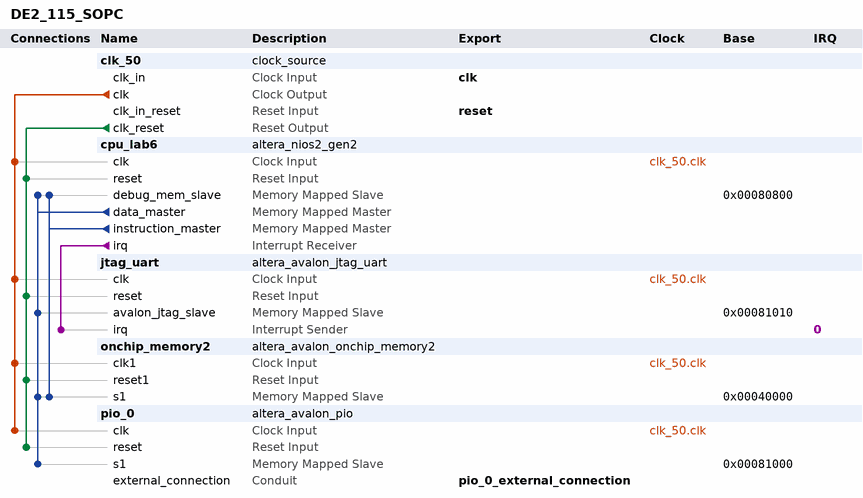
[diagram p0: system contents]
# Platform Designer (Qsys) system DE2_115_SOPC, Cyclone IV E EP4CE115F29C7
# Parameters at their usual value, and those the tool derives, are not listed.
package require -exact qsys 22.1
create_system DE2_115_SOPC
set_project_property DEVICE_FAMILY {Cyclone IV E}
set_project_property DEVICE EP4CE115F29C7

add_instance clk_50 clock_source 22.1
set_instance_parameter_value clk_50 clockFrequency 50000000

add_instance cpu_lab6 altera_nios2_gen2 22.1
set_instance_parameter_value cpu_lab6 dcache_size 2048
set_instance_parameter_value cpu_lab6 exceptionSlave onchip_memory2.s1
set_instance_parameter_value cpu_lab6 icache_size 4096
set_instance_parameter_value cpu_lab6 impl Fast
set_instance_parameter_value cpu_lab6 resetSlave onchip_memory2.s1

add_instance jtag_uart altera_avalon_jtag_uart 22.1
set_instance_parameter_value jtag_uart simInteractiveOptions NO_INTERACTIVE_WINDOWS

add_instance onchip_memory2 altera_avalon_onchip_memory2 22.1
set_instance_parameter_value onchip_memory2 dataWidth 32
set_instance_parameter_value onchip_memory2 dualPort false
set_instance_parameter_value onchip_memory2 initMemContent true
set_instance_parameter_value onchip_memory2 initializationFileName onchip_mem.hex
set_instance_parameter_value onchip_memory2 memorySize 204800

add_instance pio_0 altera_avalon_pio 22.1
set_instance_parameter_value pio_0 direction Output
set_instance_parameter_value pio_0 width 8

# connections
add_connection clk_50.clk cpu_lab6.clk clock
add_connection clk_50.clk jtag_uart.clk clock
add_connection clk_50.clk onchip_memory2.clk1 clock
add_connection clk_50.clk pio_0.clk clock
add_connection clk_50.clk_reset cpu_lab6.reset reset
add_connection clk_50.clk_reset jtag_uart.reset reset
add_connection clk_50.clk_reset onchip_memory2.reset1 reset
add_connection clk_50.clk_reset pio_0.reset reset
add_connection cpu_lab6.data_master cpu_lab6.debug_mem_slave avalon
set_connection_parameter_value cpu_lab6.data_master/cpu_lab6.debug_mem_slave baseAddress 0x00080800
add_connection cpu_lab6.data_master jtag_uart.avalon_jtag_slave avalon
set_connection_parameter_value cpu_lab6.data_master/jtag_uart.avalon_jtag_slave baseAddress 0x00081010
add_connection cpu_lab6.data_master onchip_memory2.s1 avalon
set_connection_parameter_value cpu_lab6.data_master/onchip_memory2.s1 baseAddress 0x00040000
add_connection cpu_lab6.data_master pio_0.s1 avalon
set_connection_parameter_value cpu_lab6.data_master/pio_0.s1 baseAddress 0x00081000
add_connection cpu_lab6.instruction_master cpu_lab6.debug_mem_slave avalon
set_connection_parameter_value cpu_lab6.instruction_master/cpu_lab6.debug_mem_slave baseAddress 0x00080800
add_connection cpu_lab6.instruction_master onchip_memory2.s1 avalon
set_connection_parameter_value cpu_lab6.instruction_master/onchip_memory2.s1 baseAddress 0x00040000
add_connection cpu_lab6.irq jtag_uart.irq interrupt
set_connection_parameter_value cpu_lab6.irq/jtag_uart.irq irqNumber 0

# exported interfaces
add_interface clk clock sink
set_interface_property clk EXPORT_OF clk_50.clk_in
add_interface pio_0_external_connection conduit end
set_interface_property pio_0_external_connection EXPORT_OF pio_0.external_connection
add_interface reset reset sink
set_interface_property reset EXPORT_OF clk_50.clk_in_reset

set_interconnect_requirement {$system} qsys_mm.clockCrossingAdapter HANDSHAKE
set_interconnect_requirement {$system} qsys_mm.enableEccProtection FALSE
set_interconnect_requirement {$system} qsys_mm.insertDefaultSlave FALSE
set_interconnect_requirement {$system} qsys_mm.maxAdditionalLatency 1

save_system DE2_115_SOPC.qsys
